# EAGLE design center_v2 (EAGLE 9.5.0)
REV: p2; TITLE: Elemental Center
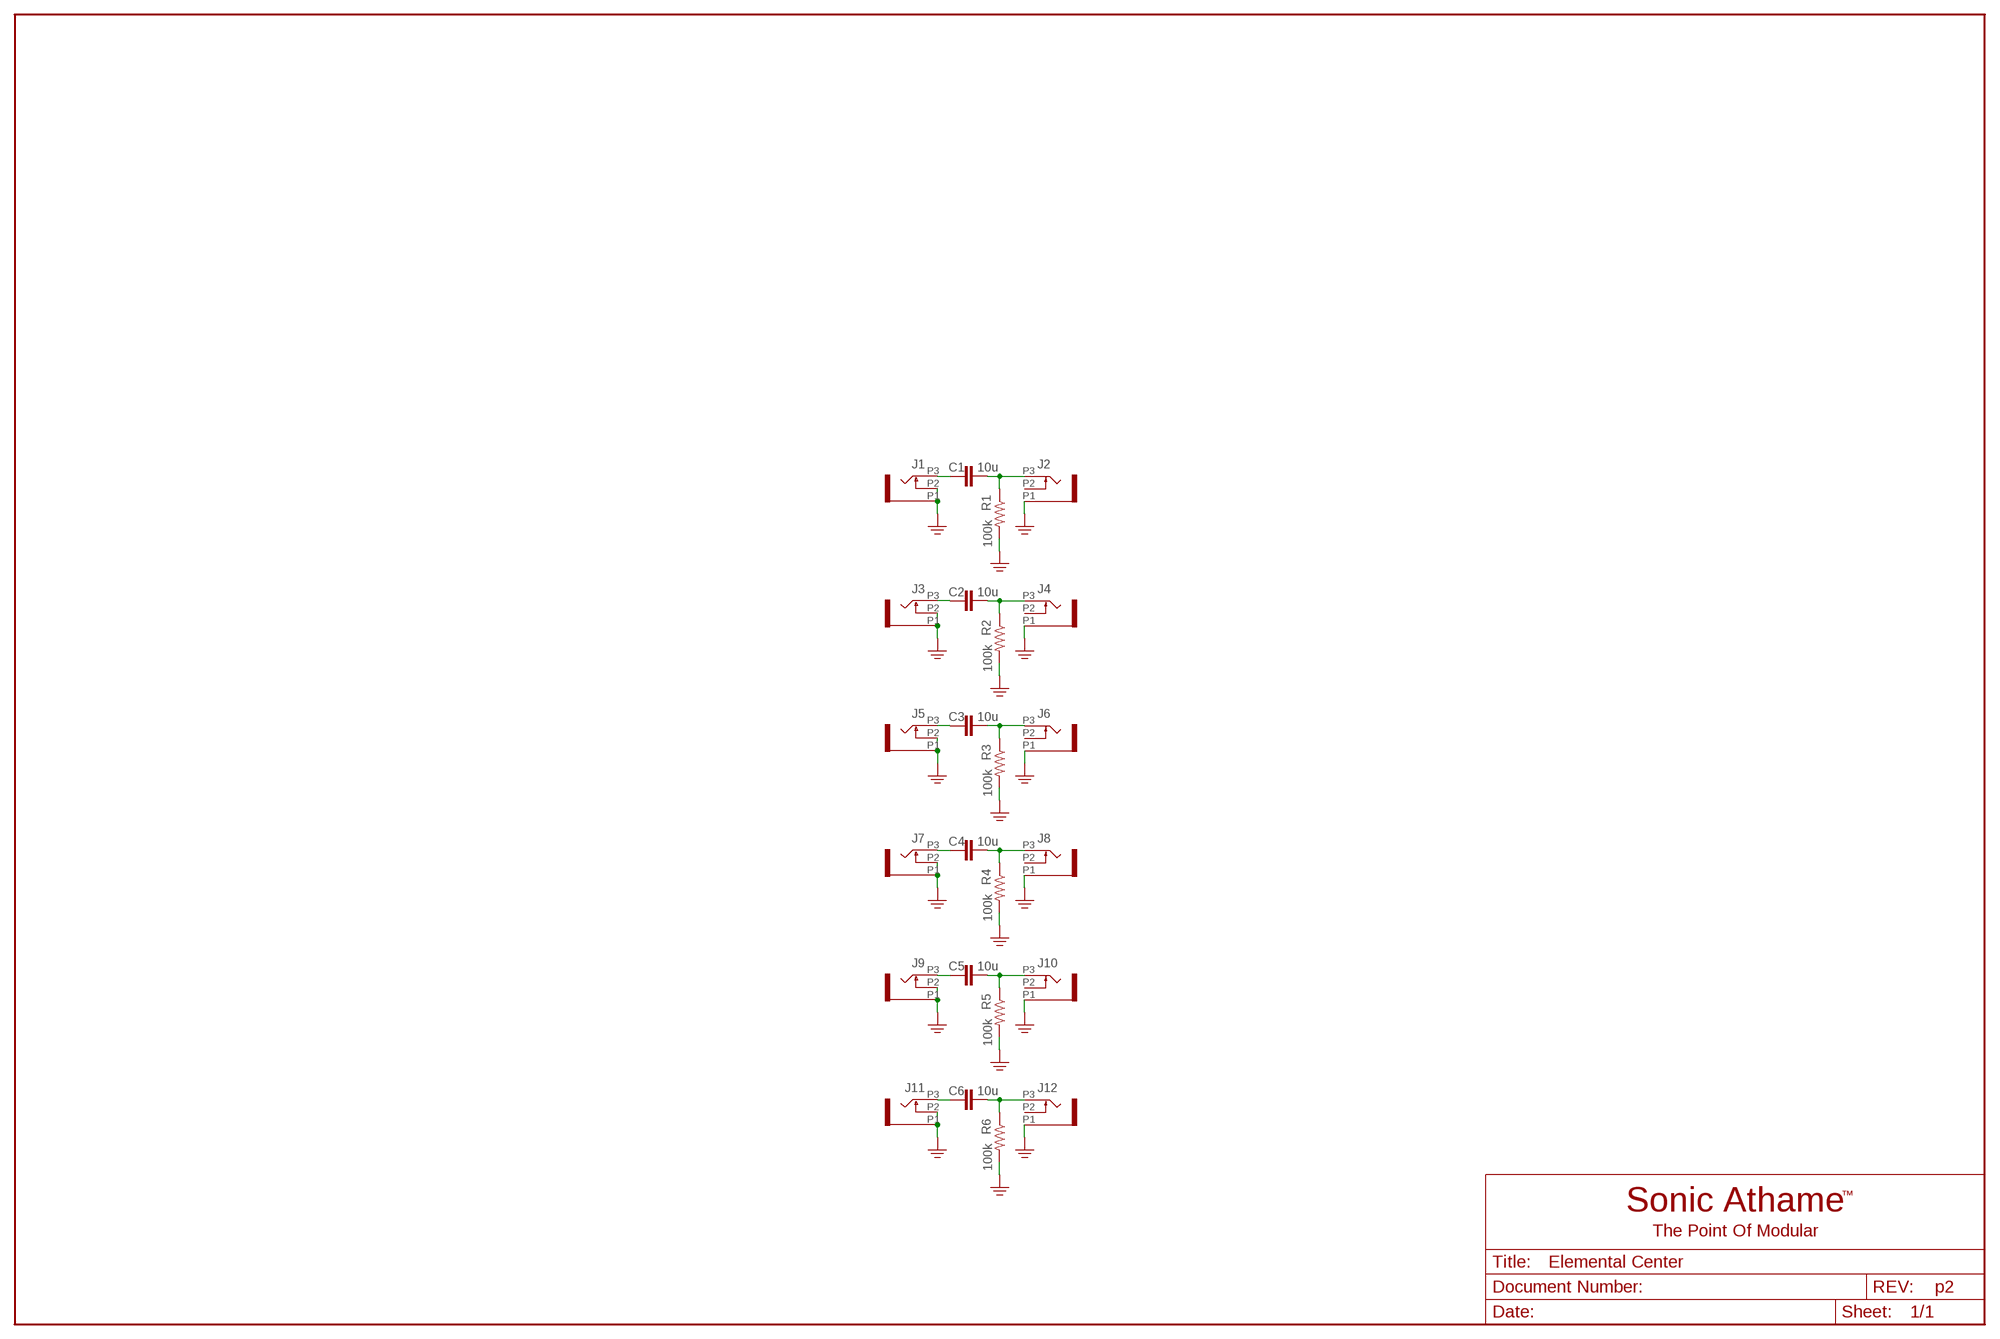
[diagram p0: schematic, sheet 1]

## Parts
C1  10u  CAP_NONPOL025-024X044  [C025-024X044]
C2  10u  CAP_NONPOL025-024X044  [C025-024X044]
C3  10u  CAP_NONPOL025-024X044  [C025-024X044]
C4  10u  CAP_NONPOL025-024X044  [C025-024X044]
C5  10u  CAP_NONPOL025-024X044  [C025-024X044]
C6  10u  CAP_NONPOL025-024X044  [C025-024X044]
J1  WQP-PJ398SM6  [WQP_PJ_301M6]
J2  WQP-PJ398SM6  [WQP_PJ_301M6]
J3  WQP-PJ398SM6  [WQP_PJ_301M6]
J4  WQP-PJ398SM6  [WQP_PJ_301M6]
J5  WQP-PJ398SM6  [WQP_PJ_301M6]
J6  WQP-PJ398SM6  [WQP_PJ_301M6]
J7  WQP-PJ398SM6  [WQP_PJ_301M6]
J8  WQP-PJ398SM6  [WQP_PJ_301M6]
J9  WQP-PJ398SM6  [WQP_PJ_301M6]
J10  WQP-PJ398SM6  [WQP_PJ_301M6]
J11  WQP-PJ398SM6  [WQP_PJ_301M6]
J12  WQP-PJ398SM6  [WQP_PJ_301M6]
R1  100k  RESISTOR0207/2V  [0207/2V]
R2  100k  RESISTOR0207/2V  [0207/2V]
R3  100k  RESISTOR0207/2V  [0207/2V]
R4  100k  RESISTOR0207/2V  [0207/2V]
R5  100k  RESISTOR0207/2V  [0207/2V]
R6  100k  RESISTOR0207/2V  [0207/2V]

## Nets
GND: J1.P1 J1.P2 J2.P1 J3.P1 J3.P2 J4.P1 J5.P1 J5.P2 J6.P1 J7.P1 J7.P2 J8.P1 J9.P1 J9.P2 J10.P1 J11.P1 J11.P2 J12.P1 R1.2 R2.2 R3.2 R4.2 R5.2 R6.2
N$1: C1.1 J1.P3
N$2: C1.2 J2.P3 R1.1
N$3: C2.2 J4.P3 R2.1
N$4: C2.1 J3.P3
N$5: C3.2 J6.P3 R3.1
N$6: C3.1 J5.P3
N$7: C4.1 J7.P3
N$8: C4.2 J8.P3 R4.1
N$9: C5.1 J9.P3
N$10: C5.2 J10.P3 R5.1
N$11: C6.2 J12.P3 R6.1
N$12: C6.1 J11.P3
Unconnected: J2.P2 J4.P2 J6.P2 J8.P2 J10.P2 J12.P2

## Library data of the parts
C1-C6 = SonicAthame:CAP_NONPOL: CAPACITOR, European symbol; SPICEPREFIX: C
J1-J12 = SonicAthame:WQP-PJ398SM
R1-R6 = SonicAthame:RESISTOR: RESISTOR, American symbol; SPICEPREFIX: R

## Board
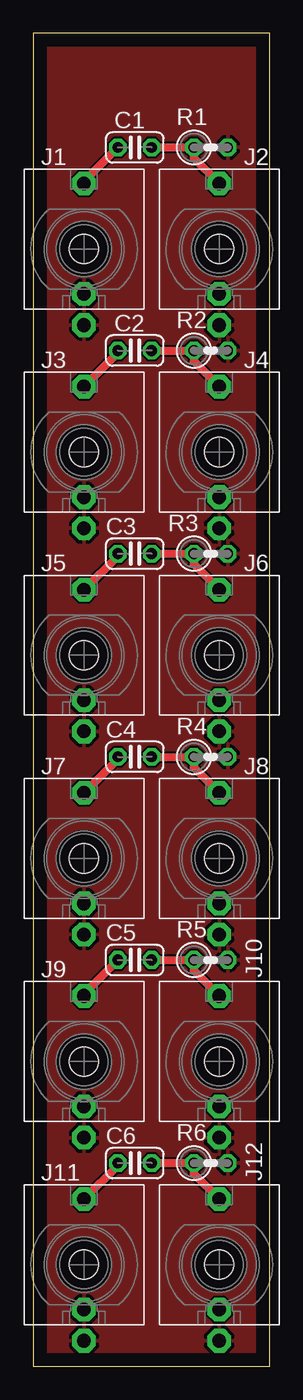
[diagram p1: board, top side]
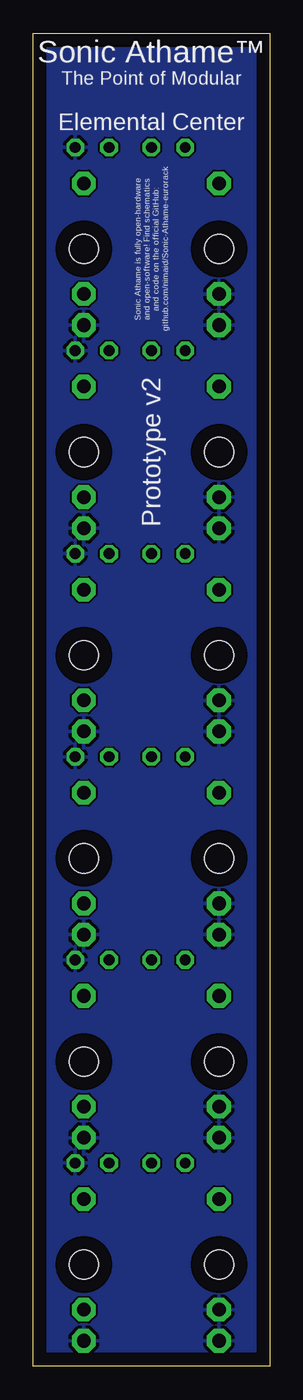
[diagram p2: board, bottom side, seen from below]

Size 17.76 x 100 mm. Coordinates in mm from the lower left corner, seen from the top.
Outline: 0,0 17.76,0 17.76,100 0,100 0,0
Copper layers (1*16): Top 0.035mm / dielectric 1.5mm / Bottom 0.035mm
Design rules "default": minimum track width 6mil, minimum drill 0.35mm, track to track 6mil, track to pad 6mil, pad to pad 6mil, via to via 6mil, smd to smd 6mil, copper to edge 40mil, drill to drill 6mil, minimum pad ring 10mil, minimum via ring 8mil, stop-mask expansion 4mil, vias tented up to drill 0mil, thermal gap 10mil

### Footprints (pad centres in the part's own frame; a part is rotated, then mirrored left to right if it is on the bottom)
C025-024X044 = drill 0.813 octagon: 1 -1.27,0; 2 1.27,0
WQP_PJ_301M6 = drill 1.016 pad 1.778 octagon: P1 0,-5.715; P2 0,-3.38; P3 0,4.92 | hole 2.2: 0,0
0207/2V = drill 0.813 octagon: 1 -1.27,0; 2 1.27,0

### Placement (x,y rotation side)
C1  7.62,91.44 0 top
C2  7.62,76.2 0 top
C3  7.62,60.96 0 top
C4  7.62,45.72 0 top
C5  7.62,30.48 0 top
C6  7.62,15.24 0 top
J1  3.81,83.82 0 top
J2  13.97,83.82 0 top
J3  3.81,68.58 0 top
J4  13.97,68.58 0 top
J5  3.81,53.34 0 top
J6  13.97,53.34 0 top
J7  3.81,38.1 0 top
J8  13.97,38.1 0 top
J9  3.81,22.86 0 top
J10  13.97,22.86 0 top
J11  3.81,7.62 0 top
J12  13.97,7.62 0 top
R1  13.34,91.44 0 top
R2  13.34,76.2 0 top
R3  13.34,60.96 0 top
R4  13.34,45.72 0 top
R5  13.34,30.48 0 top
R6  13.34,15.24 0 top

### Tracks (layer width: path | path; a pad name or v marks a point on that pad's centre or on a via)
GND
  pour Bottom: 0,0 17.78,0 17.78,100.33 0,100.33
  pour Top: 0,0 17.78,0 17.78,100.33 0,100.33
N$1
  Top 0.61: J1.P3 3.81,88.9 C1.1
N$2
  Top 0.61: C1.2 R1.1 12.06,90.64 J2.P3
N$3
  Top 0.61: C2.2 R2.1 12.06,75.41 J4.P3
N$4
  Top 0.61: J3.P3 6.35,76.04 C2.1
N$5
  Top 0.61: C3.2 R3.1 12.06,60.16 J6.P3
N$6
  Top 0.61: J5.P3 6.35,60.8 C3.1
N$7
  Top 0.61: J7.P3 6.35,45.56 C4.1
N$8
  Top 0.61: C4.2 R4.1 12.06,44.92 J8.P3
N$9
  Top 0.61: J9.P3 3.81,27.94 C5.1
N$10
  Top 0.61: C5.2 R5.1 12.06,29.68 J10.P3
N$11
  Top 0.61: C6.2 R6.1 12.06,14.45 J12.P3
N$12
  Top 0.61: J11.P3 6.35,15.08 C6.1

### Text on the board
bNames: Sonic Athame™ | The Point of Modular | Elemental Center | Sonic Athame is fully open-hardware / and open-software! Find schematics / and code on the official GitHub: / github.com/nimaid/Sonic-Athame-eurorack | Prototype v2